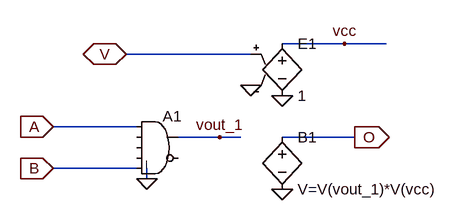
[diagram p0: schematic logic_and.asc]
logic_and.asc, the LTspice schematic file:
Version 4.1
SHEET 1 880 680
WIRE 368 32 272 32
WIRE 432 32 368 32
WIRE 224 48 32 48
WIRE 48 160 -80 160
WIRE 176 176 112 176
WIRE 208 176 176 176
WIRE 384 176 272 176
WIRE 48 224 -80 224
WIRE 64 240 64 224
FLAG -80 160 A
IOPIN -80 160 In
FLAG -80 224 B
IOPIN -80 224 In
FLAG 384 176 O
IOPIN 384 176 Out
FLAG 32 48 V
IOPIN 32 48 BiDir
FLAG 272 256 0
FLAG 176 176 vout_1
FLAG 224 96 0
FLAG 272 112 0
FLAG 64 240 0
FLAG 368 32 vcc
SYMBOL Digital\\and 80 128 R0
SYMATTR InstName A1
SYMBOL bv 272 160 R0
SYMATTR InstName B1
SYMATTR Value V=V(vout_1)*V(vcc)
SYMBOL e 272 16 R0
SYMATTR InstName E1
SYMATTR Value 1

The netlist it stands for:
* logic_and.asc
A1 A 0 0 0 B 0 vout_1 0 AND
B1 O 0 V=V(vout_1)*V(vcc)
E1 vcc 0 V 0 1
.backanno
.end